# Altium project PCB_Project1.PrjPCB
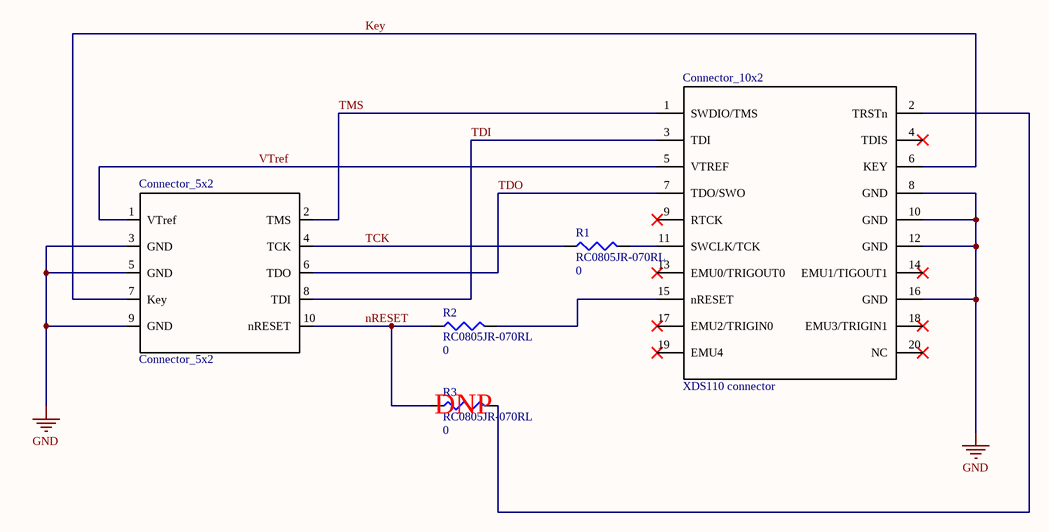
[diagram p0: 20to10pin.SchDoc]
1 sheet, 5 parts. Net scope: global (net labels, ports and power ports of the same name join across sheets).
Board file: PCB1.PcbDoc

## Sheet 20to10pin.SchDoc
size A

### Parts
Connector_5x2  Connector_5x2  [5x2 pin]
Connector_10x2  XDS110 connector  [10x2 pin]
R1  RC0805JR-070RL  value 0  [J1-0603]
R2  RC0805JR-070RL  value 0  [J1-0603]
R3  RC0805JR-070RL  value 0  [J1-0603]

### Nets
GND: Connector_5x2.3(GND) Connector_5x2.5(GND) Connector_5x2.9(GND) Connector_10x2.8(GND) Connector_10x2.10(GND) Connector_10x2.12(GND) Connector_10x2.16(GND)
Key: Connector_5x2.7(Key) Connector_10x2.6(KEY)
nRESET: Connector_5x2.10(nRESET) R2.1 R3.1
TCK: Connector_5x2.4(TCK) R1.1
TDI: Connector_5x2.8(TDI) Connector_10x2.3(TDI)
TDO: Connector_5x2.6(TDO) Connector_10x2.7(TDO/SWO)
TMS: Connector_5x2.2(TMS) Connector_10x2.1(SWDIO/TMS)
VTref: Connector_5x2.1(VTref) Connector_10x2.5(VTREF)
NetConnector_10x2_2: Connector_10x2.2(TRSTn) R3.2
NetConnector_10x2_11: Connector_10x2.11(SWCLK/TCK) R1.2
NetConnector_10x2_15: Connector_10x2.15(nRESET) R2.2

Not connected (* = marked no-connect by the designer): Connector_10x2 4(TDIS)* 9(RTCK)* 13(EMU0/TRIGOUT0)* 14(EMU1/TIGOUT1)* 17(EMU2/TRIGIN0)* 18(EMU3/TRIGIN1)* 19(EMU4)* 20(NC)*

### Notes on the sheet
- (near R3) DNP

### Library data of the parts
R1-R3 = Res3: Resistor; Published: 8-Jun-2000; LatestRevisionDate: 29-May-2009; LatestRevisionNote: IPC-7351 Footprint Added.; PackageReference: J1-0603; Publisher: Altium Limited; PackageDescription: Chip Resistor